# EAGLE schematic untitled (EAGLE 6.4)
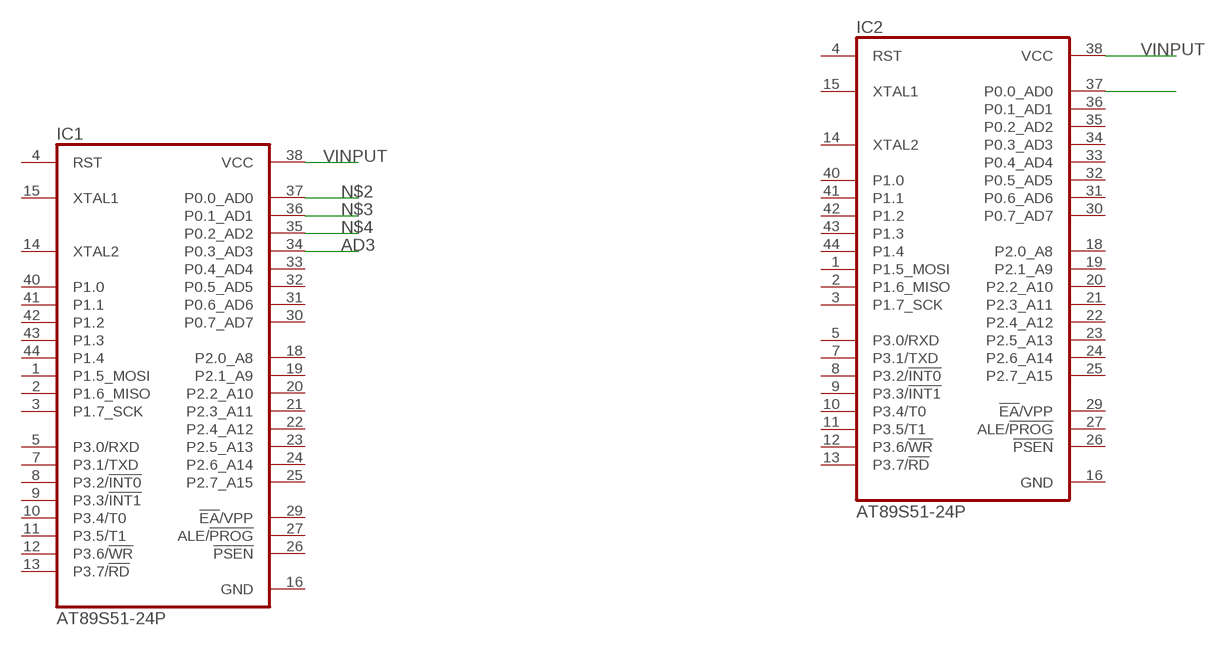
[diagram p0: schematic, sheet 1]

## Parts
IC1  AT89S51-24P  [TQFP44]
IC2  AT89S51-24P  [TQFP44]

## Nets
AD3: IC1.34(P0.3_AD3) IC2.37(P0.0_AD0)
N$2: IC1.37(P0.0_AD0)
N$3: IC1.36(P0.1_AD1)
N$4: IC1.35(P0.2_AD2)
VINPUT: IC1.38(VCC) IC2.38(VCC)
Unconnected: IC1.1(P1.5_MOSI) IC1.2(P1.6_MISO) IC1.3(P1.7_SCK) IC1.4(RST) IC1.5(P3.0/RXD) IC1.7(P3.1/TXD) IC1.8(P3.2/!INT0) IC1.9(P3.3/!INT1) IC1.10(P3.4/T0) IC1.11(P3.5/T1) IC1.12(P3.6/!WR) IC1.13(P3.7/!RD) IC1.14(XTAL2) IC1.15(XTAL1) IC1.18(P2.0_A8) IC1.19(P2.1_A9) IC1.20(P2.2_A10) IC1.21(P2.3_A11) IC1.22(P2.4_A12) IC1.23(P2.5_A13) IC1.24(P2.6_A14) IC1.25(P2.7_A15) IC1.26(!PSEN) IC1.27(ALE/!PROG) IC1.29(!EA!/VPP) IC1.30(P0.7_AD7) IC1.31(P0.6_AD6) IC1.32(P0.5_AD5) IC1.33(P0.4_AD4) IC1.40(P1.0) IC1.41(P1.1) IC1.42(P1.2) IC1.43(P1.3) IC1.44(P1.4) IC2.1(P1.5_MOSI) IC2.2(P1.6_MISO) IC2.3(P1.7_SCK) IC2.4(RST) IC2.5(P3.0/RXD) IC2.7(P3.1/TXD) IC2.8(P3.2/!INT0) IC2.9(P3.3/!INT1) IC2.10(P3.4/T0) IC2.11(P3.5/T1) IC2.12(P3.6/!WR) IC2.13(P3.7/!RD) IC2.14(XTAL2) IC2.15(XTAL1) IC2.18(P2.0_A8) IC2.19(P2.1_A9) IC2.20(P2.2_A10) IC2.21(P2.3_A11) IC2.22(P2.4_A12) IC2.23(P2.5_A13) IC2.24(P2.6_A14) IC2.25(P2.7_A15) IC2.26(!PSEN) IC2.27(ALE/!PROG) IC2.29(!EA!/VPP) IC2.30(P0.7_AD7) IC2.31(P0.6_AD6) IC2.32(P0.5_AD5) IC2.33(P0.4_AD4) IC2.34(P0.3_AD3) IC2.35(P0.2_AD2) IC2.36(P0.1_AD1) IC2.40(P1.0) IC2.41(P1.1) IC2.42(P1.2) IC2.43(P1.3) IC2.44(P1.4)

## Power pins joined to a net without a drawn wire
GND: IC1.16(GND) IC1.17(GND) IC2.16(GND) IC2.17(GND)

## Library data of the parts
IC1 IC2 = atmel:AT89S51*P: 8-bit Microcontroller with 4K BytesIn-System Programmable Flash Source: http://www.atmel.com/dyn/resources/prod_documents/doc2487.pdf; OC_FARNELL: unknown; OC_NEWARK: unknown